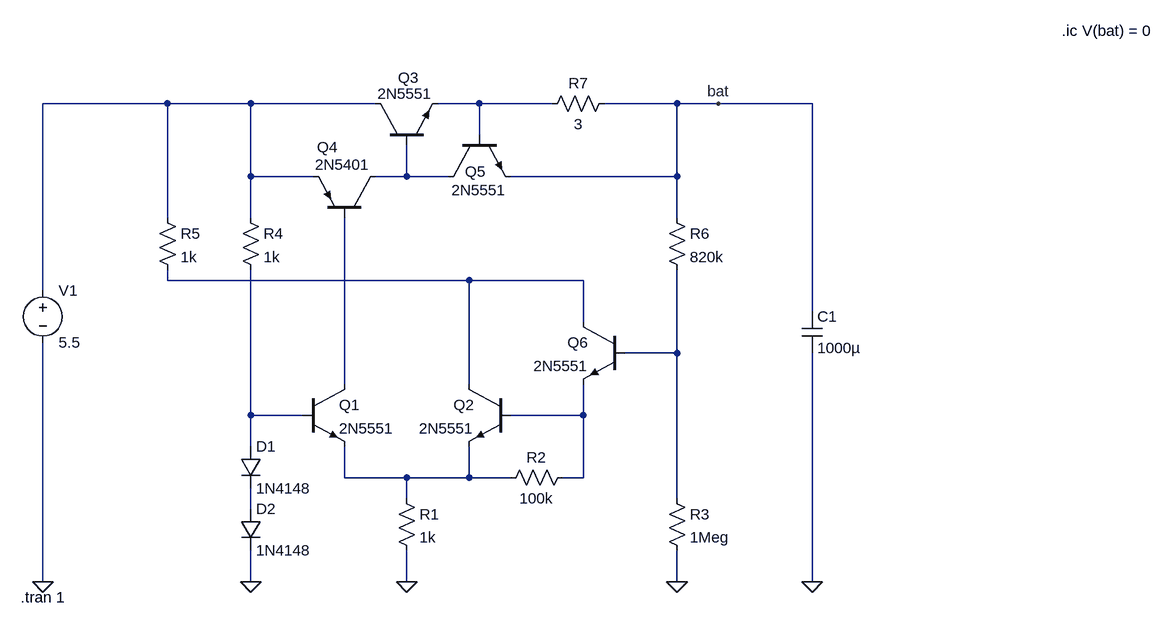
[diagram p0: schematic discrete_charger.asc]
discrete_charger.asc, the LTspice schematic file:
Version 4
SHEET 1 1420 680
WIRE -112 -160 -304 -160
WIRE 16 -160 -112 -160
WIRE 208 -160 16 -160
WIRE 368 -160 304 -160
WIRE 480 -160 368 -160
WIRE 672 -160 560 -160
WIRE 736 -160 672 -160
WIRE 880 -160 736 -160
WIRE 368 -112 368 -160
WIRE 16 -48 16 -160
WIRE 112 -48 16 -48
WIRE 256 -48 256 -96
WIRE 256 -48 208 -48
WIRE 320 -48 256 -48
WIRE 672 -48 672 -160
WIRE 672 -48 416 -48
WIRE -112 16 -112 -160
WIRE 16 16 16 -48
WIRE 672 16 672 -48
WIRE -112 112 -112 96
WIRE 352 112 -112 112
WIRE 528 112 352 112
WIRE -304 128 -304 -160
WIRE 880 160 880 -160
WIRE 528 176 528 112
WIRE 672 224 672 96
WIRE 672 224 592 224
WIRE 160 272 160 16
WIRE 352 272 352 112
WIRE 16 320 16 96
WIRE 96 320 16 320
WIRE 528 320 528 272
WIRE 528 320 416 320
WIRE 16 368 16 320
WIRE 160 416 160 368
WIRE 256 416 160 416
WIRE 352 416 352 368
WIRE 352 416 256 416
WIRE 416 416 352 416
WIRE 528 416 528 320
WIRE 528 416 496 416
WIRE 256 448 256 416
WIRE 672 448 672 224
WIRE 16 464 16 432
WIRE -304 576 -304 208
WIRE 16 576 16 528
WIRE 32 576 16 576
WIRE 256 576 256 528
WIRE 672 576 672 528
WIRE 880 576 880 224
FLAG 16 576 0
FLAG 256 576 0
FLAG 672 576 0
FLAG 880 576 0
FLAG -304 576 0
FLAG 736 -160 bat
SYMBOL npn 96 272 R0
SYMATTR InstName Q1
SYMATTR Value 2N5551
SYMBOL npn 416 272 M0
SYMATTR InstName Q2
SYMATTR Value 2N5551
SYMBOL res 240 432 R0
SYMATTR InstName R1
SYMATTR Value 1k
SYMBOL res 656 432 R0
SYMATTR InstName R3
SYMATTR Value 1Meg
SYMBOL res 0 0 R0
SYMATTR InstName R4
SYMATTR Value 1k
SYMBOL npn 208 -96 R270
WINDOW 0 104 35 VRight 2
WINDOW 3 79 3 VRight 2
SYMATTR InstName Q3
SYMATTR Value 2N5551
SYMBOL pnp 208 16 M270
WINDOW 0 109 90 VLeft 2
WINDOW 3 82 93 VLeft 2
SYMATTR InstName Q4
SYMATTR Value 2N5401
SYMBOL res -128 0 R0
SYMATTR InstName R5
SYMATTR Value 1k
SYMBOL res 656 0 R0
SYMATTR InstName R6
SYMATTR Value 820k
SYMBOL voltage -304 112 R0
WINDOW 123 0 0 Left 0
WINDOW 39 0 0 Left 0
SYMATTR InstName V1
SYMATTR Value 5.5
SYMBOL cap 864 160 R0
SYMATTR InstName C1
SYMATTR Value 1000µ
SYMBOL res 464 -144 R270
WINDOW 0 32 56 VTop 2
WINDOW 3 0 56 VBottom 2
SYMATTR InstName R7
SYMATTR Value 3
SYMBOL npn 320 -112 M90
WINDOW 0 57 58 VLeft 2
WINDOW 3 85 90 VLeft 2
SYMATTR InstName Q5
SYMATTR Value 2N5551
SYMBOL diode 0 368 R0
SYMATTR InstName D1
SYMATTR Value 1N4148
SYMBOL diode 0 464 R0
SYMATTR InstName D2
SYMATTR Value 1N4148
SYMBOL npn 592 176 M0
SYMATTR InstName Q6
SYMATTR Value 2N5551
SYMBOL res 512 400 R90
WINDOW 0 0 56 VBottom 2
WINDOW 3 32 56 VTop 2
SYMATTR InstName R2
SYMATTR Value 100k
TEXT -338 600 Left 2 !.tran 1
TEXT 1264 -272 Left 2 !.ic V(bat) = 0

The netlist it stands for:
* discrete_charger.asc
Q1 N006 N007 N009 0 2N5551
Q2 N004 N008 N009 0 2N5551
R1 N009 0 1k
R3 N005 0 1Meg
R4 N001 N007 1k
Q3 N001 N003 N002 0 2N5551
Q4 N003 N006 N001 0 2N5401
R5 N001 N004 1k
R6 bat N005 820k
V1 N001 0 5.5
C1 bat 0 1000µ
R7 N002 bat 3
Q5 N003 N002 bat 0 2N5551
D1 N007 N010 1N4148
D2 N010 0 1N4148
Q6 N004 N005 N008 0 2N5551
R2 N008 N009 100k
.model D D
.lib standard.dio
.model NPN NPN
.model PNP PNP
.lib standard.bjt
.tran 1
.ic V(bat) = 0
.backanno
.end